# Altium schematic sheet ELSE_Perif.SchDoc
size A4
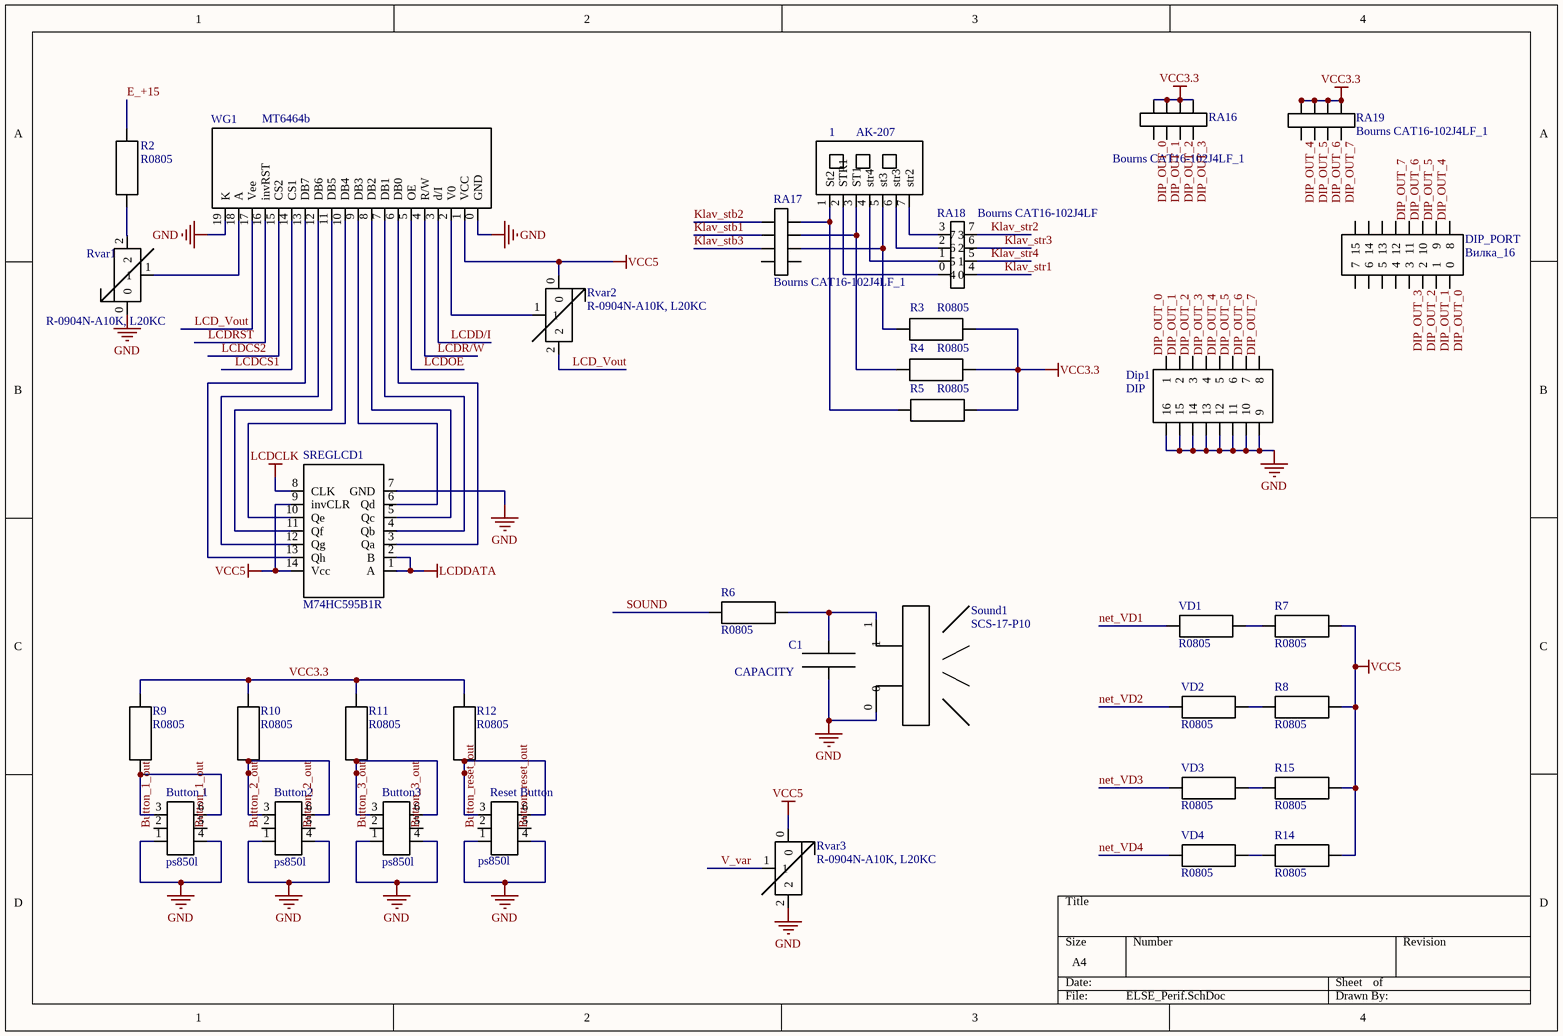
[diagram p0: ELSE_Perif.SchDoc]

## Parts
1  AK-207  [AK-207]
Button2  ps850l  [ps850l]
Button3  ps850l  [ps850l]
Button_1  ps850l  [ps850l]
C1  CAPACITY  [R0805]
Dip1  DIP  [SWD1-8]
DIP_PORT  Вилка_16  [DS1013-16]
R2  R0805  [R0805]
R3  R0805  [R0805]
R4  R0805  [R0805]
R5  R0805  [R0805]
R6  R0805  [R0805]
R7  R0805  [R0805]
R8  R0805  [R0805]
R9  R0805  [R0805]
R10  R0805  [R0805]
R11  R0805  [R0805]
R12  R0805  [R0805]
R14  R0805  [R0805]
R15  R0805  [R0805]
RA16  Bourns CAT16-102J4LF_1  [CAT16-102J4LF_2]
RA17  Bourns CAT16-102J4LF_1  [CAT16-102J4LF_2]
RA18  Bourns CAT16-102J4LF  [CAT16-102J4LF]
RA19  Bourns CAT16-102J4LF_1  [CAT16-102J4LF_2]
Reset_Button  ps850l  [ps850l]
Rvar1  R-0904N-A10K, L20KC  [R-0904N-A10K, L20KC]
Rvar2  R-0904N-A10K, L20KC  [R-0904N-A10K, L20KC]
Rvar3  R-0904N-A10K, L20KC  [R-0904N-A10K, L20KC]
Sound1  SCS-17-P10  [SCS-17-P10]
SREGLCD1  M74HC595B1R  [SN74HC164DRX]
VD1  R0805  [R0805]
VD2  R0805  [R0805]
VD3  R0805  [R0805]
VD4  R0805  [R0805]
WG1  MT6464b  [WG12864A]

## Nets
GND: Button2.1 Button2.4 Button3.1 Button3.4 Button_1.1 Button_1.4 C1.1 Dip1.9 Dip1.10 Dip1.11 Dip1.12 Dip1.13 Dip1.14 Dip1.15 Dip1.16 Reset_Button.1 Reset_Button.4 Rvar1.0 Rvar3.2 Sound1.0 SREGLCD1.7(GND) WG1.0(GND) WG1.19(K)
LCDCLK: SREGLCD1.8(CLK)
LCDDATA: SREGLCD1.1(A) SREGLCD1.2(B)
VCC3.3: R3.1 R4.1 R5.1 R9.1 R10.1 R11.1 R12.1 RA16.4 RA16.5 RA16.6 RA16.7 RA19.4 RA19.5 RA19.6 RA19.7
VCC5: R7.2 R8.2 R14.2 R15.2 Rvar2.0 Rvar3.0 SREGLCD1.9(invCLR) SREGLCD1.14(Vcc) WG1.1(VCC)
Button_1_out: Button_1.2 Button_1.5
Button_2_out: Button2.2 Button2.5
Button_3_out: Button3.2 Button3.5
Button_reset_out: Reset_Button.2 Reset_Button.5
DIP_OUT_0: Dip1.1 DIP_PORT.0 RA16.0
DIP_OUT_1: Dip1.2 DIP_PORT.1 RA16.1
DIP_OUT_2: Dip1.3 DIP_PORT.2 RA16.2
DIP_OUT_3: Dip1.4 DIP_PORT.3 RA16.3
DIP_OUT_4: Dip1.5 DIP_PORT.8 RA19.0
DIP_OUT_5: Dip1.6 DIP_PORT.9 RA19.1
DIP_OUT_6: Dip1.7 DIP_PORT.10 RA19.2
DIP_OUT_7: Dip1.8 DIP_PORT.11 RA19.3
E_+15: R2.2
Klav_stb1: RA17.2
Klav_stb2: RA17.3
Klav_stb3: RA17.1
Klav_str1: RA18.4
Klav_str2: RA18.7
Klav_str3: RA18.6
Klav_str4: RA18.5
LCD_Vout: Rvar2.2 WG1.17(Vee)
LCDCS1: WG1.14(CS1)
LCDCS2: WG1.15(CS2)
LCDD/I: WG1.3(d/I)
LCDOE: WG1.5(OE)
LCDR/W: WG1.4(R/W)
LCDRST: WG1.16(invRST)
net_VD1: VD1.1
net_VD2: VD2.1
net_VD3: VD3.1
net_VD4: VD4.1
SOUND: R6.1
V_var: Rvar3.1
Net1_1: 1.1(St2) R5.2 RA17.4
Net1_2: 1.2(STR1) RA18.0
Net1_3: 1.3(ST1) R4.2 RA17.5
Net1_4: 1.4(str4) RA18.1
Net1_5: 1.5(st3) R3.2 RA17.6
Net1_6: 1.6(str3) RA18.2
Net1_7: 1.7(str2) RA18.3
NetButton2_3: Button2.3 Button2.6 R10.2
NetButton3_3: Button3.3 Button3.6 R11.2
NetButton_1_3: Button_1.3 Button_1.6 R9.2
NetC1_2: C1.2 R6.2 Sound1.1
NetR2_1: R2.1 Rvar1.2
NetR7_1: R7.1 VD1.2
NetR8_1: R8.1 VD2.2
NetR12_2: R12.2 Reset_Button.3 Reset_Button.6
NetR14_1: R14.1 VD4.2
NetR15_1: R15.1 VD3.2
NetRvar1_1: Rvar1.1 WG1.18(A)
NetRvar2_1: Rvar2.1 WG1.2(V0)
NetSREGLCD1_3: SREGLCD1.3(Qa) WG1.6(DB0)
NetSREGLCD1_4: SREGLCD1.4(Qb) WG1.7(DB1)
NetSREGLCD1_5: SREGLCD1.5(Qc) WG1.8(DB2)
NetSREGLCD1_6: SREGLCD1.6(Qd) WG1.9(DB3)
NetSREGLCD1_10: SREGLCD1.10(Qe) WG1.10(DB4)
NetSREGLCD1_11: SREGLCD1.11(Qf) WG1.11(DB5)
NetSREGLCD1_12: SREGLCD1.12(Qg) WG1.12(DB6)
NetSREGLCD1_13: SREGLCD1.13(Qh) WG1.13(DB7)

Not connected (* = marked no-connect by the designer): DIP_PORT 4 5 6 7 12 13 14 15; RA17 0 7

## Library data of the parts
DIP_PORT = DS1013-16: 16_pin